# Altium schematic sheet Sheet1.SchDoc: Stm32 Breakout
size B; ApprovedBy: Abhay; Author: Abhay; CompanyName: Abhay; SheetNumber: 1; SheetTotal: 1; Project: STM32 Breakout; ENG_APP_DATE: --/--/--; DSN_APP_DATE: --/--/--; CHK_APP_DATE: --/--/--
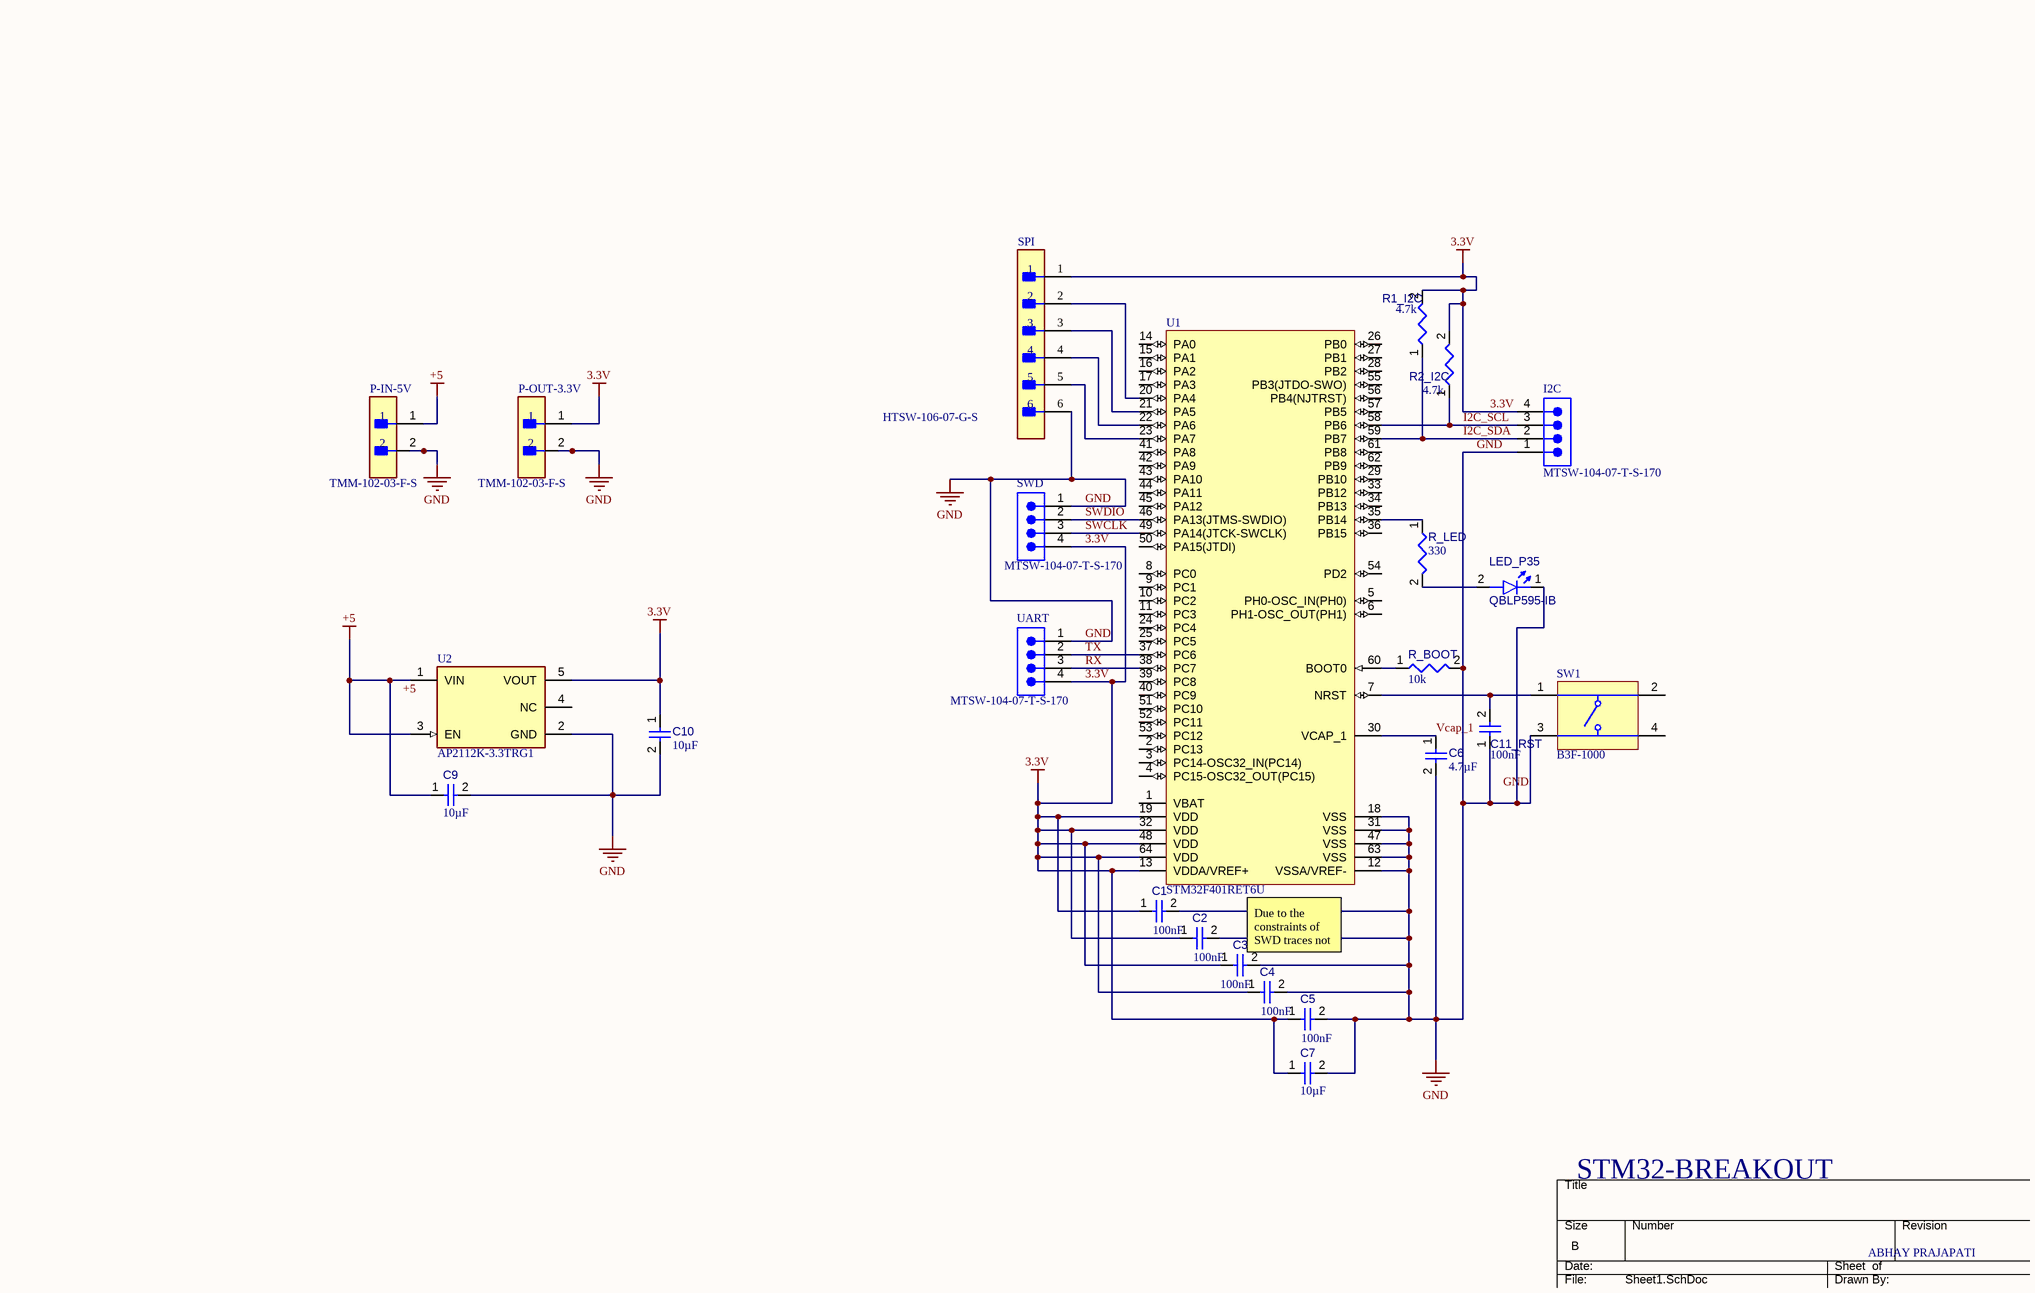
[diagram p0: Sheet1.SchDoc]

## Parts
C1  value 100nF  [CAPC0402(1005)60_L]  (hidden comment: Capacitor 100nF +/-20% 25V 0402)
C2  value 100nF  [CAPC0402(1005)60_L]  (hidden comment: Capacitor 100nF +/-20% 25V 0402)
C3_NOT  value 100nF  [CAPC0402(1005)60_L]  (hidden comment: Capacitor 100nF +/-20% 25V 0402)
C4  value 100nF  [CAPC0402(1005)60_L]  (hidden comment: Capacitor 100nF +/-20% 25V 0402)
C5  value 100nF  [CAPC0402(1005)60_L]  (hidden comment: Capacitor 100nF +/-20% 25V 0402)
C6  value 4.7µF  [CAPC0603(1608)100_L]  (hidden comment: Capacitor 4.7µF +/-20% 10V 0603)
C7  value 10µF  [FP-GRM21B-0_1-IPC_B]  (hidden comment: GRM21BR61C106KE15K)
C9  value 10µF  [CAPC2013X135X45NL10T25]  (hidden comment: Capacitor 10 uF +/- 10% 16 V 0805)
C10  value 10µF  [CAPC2013X135X45NL10T25]  (hidden comment: Capacitor 10 uF +/- 10% 16 V 0805)
C11_RST  value 100nF  [CAPC1608X90X40NL10T20]  (hidden comment: Capacitor 100 nF +/-10% 50 V 0603)
I2C  MTSW-104-07-T-S-170  [SMTC-MTSW-104-07-X-S-170]
LED_P35  QBLP595-IB  [QTB-QBLP595_V]
P-IN-5V  TMM-102-03-F-S  [FP-TMM-102-03-F-S-MFG]
P-OUT-3.3V  TMM-102-03-F-S  [FP-TMM-102-03-F-S-MFG]
R1_I2C  value 4.7k  [RESC0402(1005)_L]  (hidden comment: 4D7KR2F)
R2_I2C  value 4.7k  [RESC0402(1005)_L]  (hidden comment: 4D7KR2F)
R_BOOT  value 10k  [RESC3216X60X45ML15T20]  (hidden comment: Resistor 10k +/-1% 1206 250 mW)
R_LED  value 330  [RESC0402(1005)_L]  (hidden comment: 330R2J)
SPI  HTSW-106-07-G-S  [FP-HTSW-106-07-G-S-MFG]
SW1  B3F-1000  [OMRON-B3F-1000-4_V]
SWD  MTSW-104-07-T-S-170  [SMTC-MTSW-104-07-X-S-170]
U1  STM32F401RET6U  [STM-LQFP64_L]
U2  AP2112K-3.3TRG1  [FP-SOT25-IPC_B]
UART  MTSW-104-07-T-S-170  [SMTC-MTSW-104-07-X-S-170]

## Nets
3.3V: C1.1 C2.1 C3_NOT.1 C4.1 C5.1 C7.1 C10.1 I2C.4 P-OUT-3.3V.1 R1_I2C.2 R2_I2C.2 SPI.1 SWD.4 U1.13(VDDA/VREF+) U1.19(VDD) U1.32(VDD) U1.48(VDD) U1.64(VDD) U2.5(VOUT) UART.4
+5: C9.1 P-IN-5V.1 U2.1(VIN) U2.3(EN)
GND: C1.2 C2.2 C3_NOT.2 C4.2 C5.2 C6.2 C7.2 C9.2 C10.2 C11_RST.1 I2C.1 LED_P35.1(K) P-IN-5V.2 P-OUT-3.3V.2 R_BOOT.2 SPI.6 SW1.3 SWD.1 U1.12(VSSA/VREF-) U1.18(VSS) U1.31(VSS) U1.47(VSS) U1.63(VSS) U2.2(GND) UART.1
I2C_SCL: I2C.3 R2_I2C.1 U1.58(PB6)
I2C_SDA: I2C.2 R1_I2C.1 U1.59(PB7)
RX: U1.38(PC7) UART.3
SWCLK: SWD.3 U1.49(PA14(JTCK-SWCLK))
SWDIO: SWD.2 U1.46(PA13(JTMS-SWDIO))
TX: U1.37(PC6) UART.2
Vcap_1: C6.1 U1.30(VCAP_1)
NetC11_RST_2: C11_RST.2 SW1.1 U1.7(NRST)
NetLED_P35_2: LED_P35.2(A) R_LED.2
NetR_BOOT_1: R_BOOT.1 U1.60(BOOT0)
NetR_LED_1: R_LED.1 U1.35(PB14)
NetSPI_2: SPI.2 U1.20(PA4)
NetSPI_3: SPI.3 U1.21(PA5)
NetSPI_4: SPI.4 U1.22(PA6)
NetSPI_5: SPI.5 U1.23(PA7)

Not connected (* = marked no-connect by the designer): SW1 2 4; U1 1(VBAT) 2(PC13) 3(PC14-OSC32_IN(PC14)) 4(PC15-OSC32_OUT(PC15)) 5(PH0-OSC_IN(PH0)) 6(PH1-OSC_OUT(PH1)) 8(PC0) 9(PC1) 10(PC2) 11(PC3) 14(PA0) 15(PA1) 16(PA2) 17(PA3) 24(PC4) 25(PC5) 26(PB0) 27(PB1) 28(PB2) 29(PB10) 33(PB12) 34(PB13) 36(PB15) 39(PC8) 40(PC9) 41(PA8) 42(PA9) 43(PA10) 44(PA11) 45(PA12) 50(PA15(JTDI)) 51(PC10) 52(PC11) 53(PC12) 54(PD2) 55(PB3(JTDO-SWO)) 56(PB4(NJTRST)) 57(PB5) 61(PB8) 62(PB9); U2 4(NC)

## Notes on the sheet
- (near C3_NOT) Due to the constraints of SWD traces not connected to 3.3
- STM32-BREAKOUT
- ABHAY PRAJAPATI

## Library data of the parts
C1 C2 C3_NOT C4 C5 = CMP-001-00065-4: Chip Capacitor, 100nF +/-20%, 25V, 0402, Thickness 0.6 mm; Tolerance: 10%; Max Operating Temperature: 85°C; Min Operating Temperature: -55°C; Pins: 2; Voltage Rating: 25V; Mounting Technology: SMT; Case/Package: 0402
C6 = CMP-001-00076-4: Chip Capacitor, 4.7µF +/-20%, 10V, 0603, Thickness 1 mm; Tolerance: 10%; Mounting Technology: SMT; Case/Package: 0603; Pins: 2; Min Operating Temperature: -55°C; Max Operating Temperature: 85°C; Voltage Rating: 10V
C7 = CMP-001-00083-1: 16V 10uF X5R ±10% 0805 Multilayer Ceramic Capacitors MLCC - SMD/SMT ROHS; Case/Package: 0805; Tolerance: 10%; Min Operating Temperature: -55°C; Max Operating Temperature: 85°C; Voltage Rating: 16V; Mounting Technology: Surface Mount
C9 C10 = CMP-001-00015-6: Chip Capacitor, 10 uF, +/- 10%, 16 V, 0805 (2012 Metric); Voltage Rating: 16V; Capacitor Type: Ceramic; RoHS Compliant: True; Max Operating Temperature: 85°C; Min Operating Temperature: -55°C; Mounting Technology: SM; Tolerance: 10%; Case/Package: 0805; Pins: 2
C11_RST = CMP-001-00017-6: Chip Capacitor, 100 nF, +/- 10%, 50 V, 0603 (1608 Metric); Voltage Rating: 50V; Capacitor Type: Ceramic; Tolerance: 10%; Mounting Technology: SM; Max Operating Temperature: 125°C; RoHS Compliant: True; Pins: 2; Case/Package: 0603; Min Operating Temperature: -55°C
I2C SWD UART = CMP-002-00075-1: Headers & Wire Housings Variable Height PCB Header Strips, 0.100 pitch
LED_P35 = CMP-007-00042-3: Chip LED 0402, Blue, 0.02 A, 3.1 to 3.7 V, -40 to 80 degC, 2-Pin SMD, RoHS, Tape and Reel; RoHS Compliant: Yes; Colour: Blue; Pins: 2; Case/Package: 0402; Mounting Technology: SMT; Parameter 1: *
P-IN-5V P-OUT-3.3V = CMP-002-00077-1: Pin Header, Board-to-Board, Wire-to-Board, 2 mm, 1 Rows, 2 Contacts, Through Hole, TMM
R1_I2C R2_I2C = CMP-009-00105-2: 4K7 0.063W 1% 0402 (1005 Metric)  SMD; Power: 63mW; Mounting Technology: SMT; Case/Package: 0402; Tolerance: 1%; Pins: 2
R_BOOT = CMP-009-00016-5: Chip Resistor, 10 KOhm, +/- 1%, 0.25 W, -55 to 155 degC, 1206 (3216 Metric); Power: 250mW; Voltage Rating: 200V; Pins: 2; Max Operating Temperature: 155°C; Tolerance: 1%; RoHS Compliant: True; Case/Package: 1206; Min Operating Temperature: -55°C; Mounting Technology: SM
R_LED = CMP-009-00095-2: 330R 0.063W 5% 0402 (1005 Metric)  SMD; Power: 63mW; Tolerance: 5%; Mounting Technology: SMT; Case/Package: 0402; Pins: 2
SPI = CMP-002-00078-1: Pin Header, Vertical, Board-to-Board, 2.54 mm, 1 Rows, 6 Contacts, Through Hole, HTSW Series
SW1 = CMP-011-00004-2: Tactile Switch, SPST-NO, 0.05 A, 24 V, -25 to 70 degC, 4-Pin THD, RoHS, Bulk; Manufacturer: Omron Electronic Components; Throw Configuration: SPST; Max Contact Resistance: 100mohm; Resistance: 0.1Ohm; Max Current Rating: 50mA; Voltage Rating: 24V; Operating Force: 100gf; Datasheet Version: Jan-15; Case/Package: B3F-1000; Packaging: Bulk; Package Description: 4-Pin Through Hole Device, Body 6 x 6 mm; Manufacturer URL: http://www.omron.com/; Package Reference: B3F-1000; Contact Plating: Gold; Contact Current Rating: 50mA; RoHS Compliant: True; Contact Material: Gold; Mounting Technology: TH; Max Operating Temperature: 70°C; Min Operating Temperature: -25°C; Package Quantity: 1500; Datasheet URL: http://www.omron.com/ecb/products/pdf/en-b3f.pdf; Voltage Rating (DC): 24V; Pins: 4; Current Rating: 50mA; Max Voltage Rating (DC): 24V; Parameter 1: *
U1 = CMP-00000-1: MCU 32-Bit STM32 ARM Cortex M4 RISC 512KB Flash 2.5V/3.3V 64-Pin LQFP Tray; Number of I/Os: 50; Frequency: 84MHz; RAM Size: 96kB; Min Supply Voltage: 1.7V; Max Supply Voltage: 3.6V; Pins: 64; Case/Package: LQFP; REACH SVHC: No; Memory Size: 512kB; Packaging: Cut Tape; RoHS: Compliant
U2 = CMP-019-00049-1: AP2112 Series 0.6 A 3.3 V Fixed Output SMT LDO Linear Regulator - SOT23-5